# Altium schematic sheet MOSFET_Driver_Sheet1.SchDoc
size 420 x 297 mm; SheetNumber: 12; SheetTotal: 32
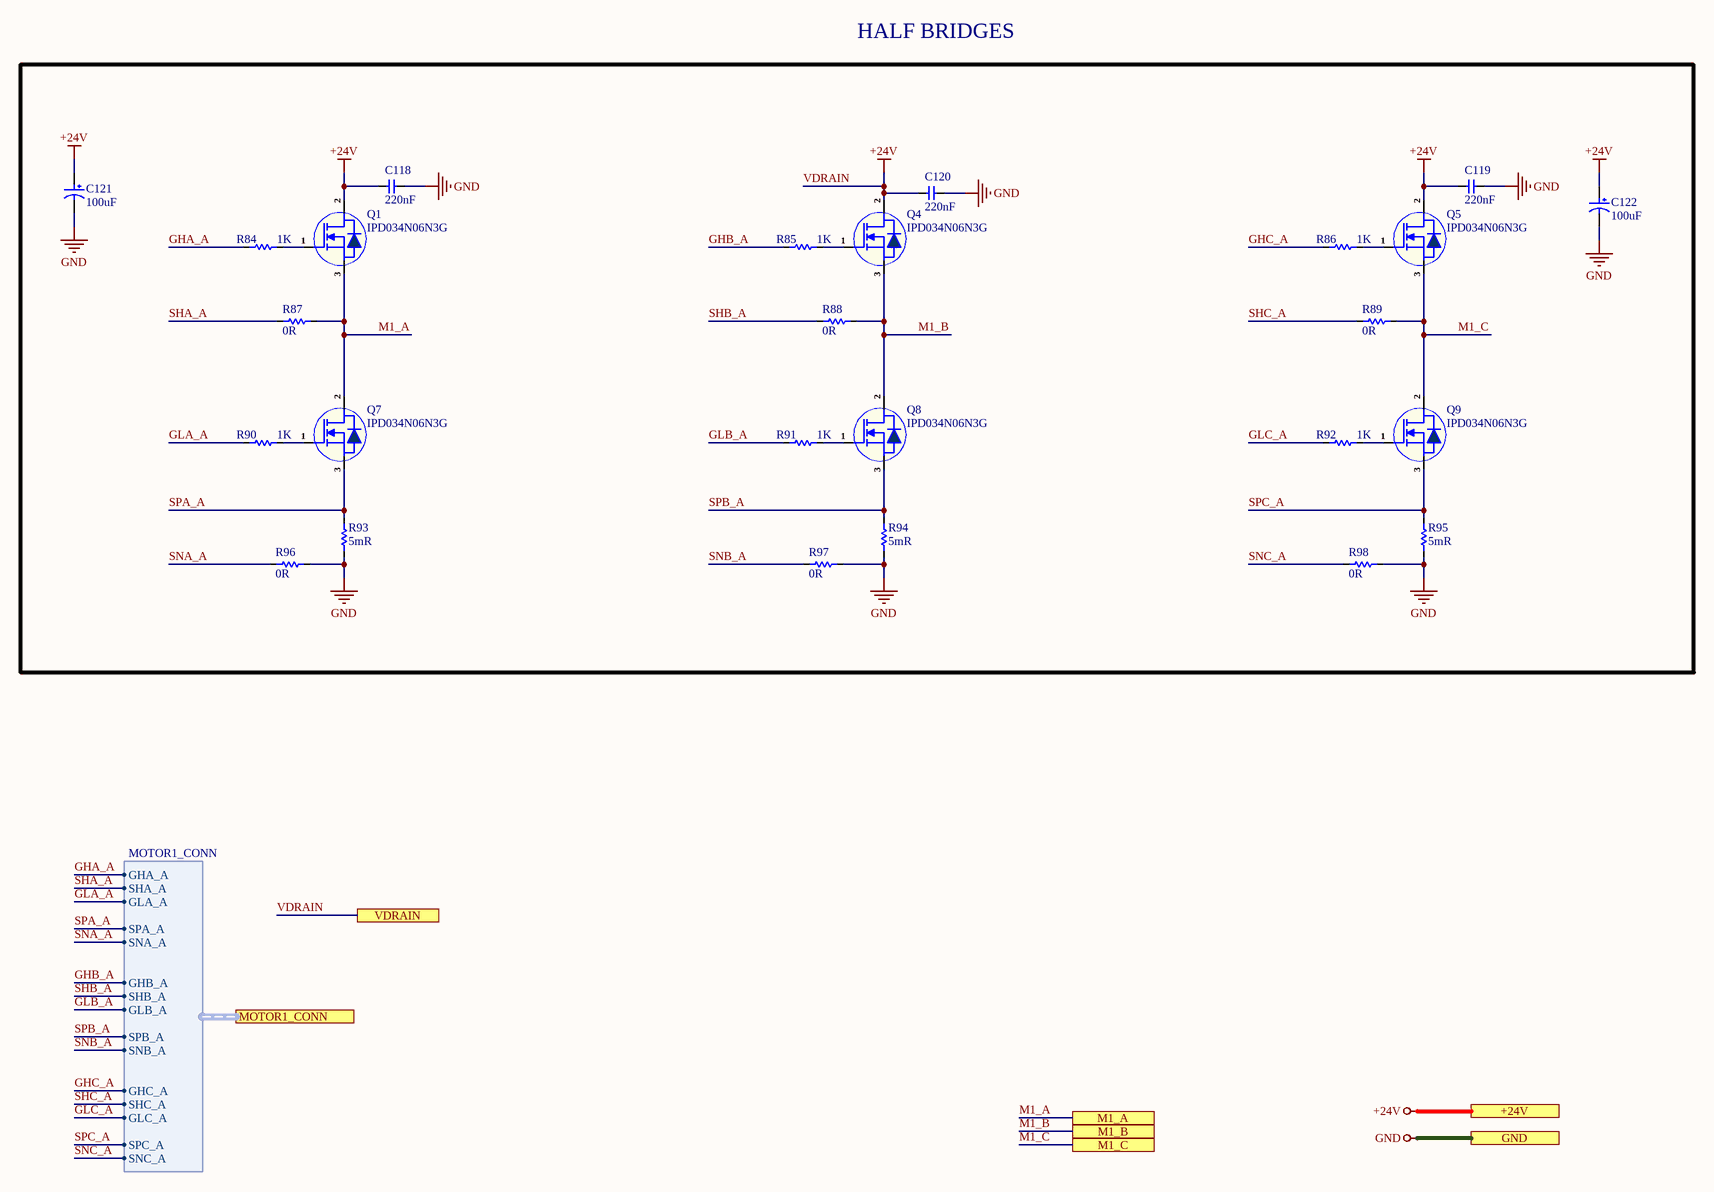
[diagram p0: MOSFET_Driver_Sheet1.SchDoc]

## Parts
C118  220nF  [Cap-0805]
C119  220nF  [Cap-0805]
C120  220nF  [Cap-0805]
C121  100uF  [RVT1A101M0605]
C122  100uF  [RVT1A101M0605]
Q1  IPD034N06N3G  [TO-252-2L]
Q4  IPD034N06N3G  [TO-252-2L]
Q5  IPD034N06N3G  [TO-252-2L]
Q7  IPD034N06N3G  [TO-252-2L]
Q8  IPD034N06N3G  [TO-252-2L]
Q9  IPD034N06N3G  [TO-252-2L]
R84  1K  [Res-0402]
R85  1K  [Res-0402]
R86  1K  [Res-0402]
R87  0R  [Res-0603]
R88  0R  [Res-0603]
R89  0R  [Res-0603]
R90  1K  [Res-0402]
R91  1K  [Res-0402]
R92  1K  [Res-0402]
R93  5mR  [Res-1206]
R94  5mR  [Res-1206]
R95  5mR  [Res-1206]
R96  0R  [Res-0603]
R97  0R  [Res-0603]
R98  0R  [Res-0603]

## Ports
+24V (see Servo1[4A], Connector_Sheet[5D], DIO_1[5D], DIO_2[5D], DIO_3[5D], DIO_4[5D], MOSFET_Driver_Sheet2[5D], MOSFET_Driver_Sheet3[5D], MOSFET_Driver_Sheet4[5D], Motor_Driver_Sheet1[5D], Motor_Driver_Sheet2[5D], Motor_Driver_Sheet3[5D], Motor_Driver_Sheet4[5D], Power_Sheet[5D]), GND (see Servo1[4B], CAN_Sheet[5D], Connector_Sheet[5D], Controller_Sheet[5D], DIO_1[5D], DIO_2[5D], DIO_3[5D], DIO_4[5D], Encoder_Sheet1[5D], Encoder_Sheet2[5D], Encoder_Sheet3[5D], Encoder_Sheet4[5D], EtherCAT_Sheet[5D], MOSFET_Driver_Sheet2[5D], MOSFET_Driver_Sheet3[5D], MOSFET_Driver_Sheet4[5D], Motor_Driver_Sheet1[5D], Motor_Driver_Sheet2[5D], Motor_Driver_Sheet3[5D], Motor_Driver_Sheet4[5D], Power_Sheet[5D], RJ45_Sheet[5D], RS485_RS232_Sheet[3D], Sec_Controller_Sheet1[5D], Sec_Controller_Sheet2[5D], Sec_Controller_Sheet3[5D], Sec_Controller_Sheet4[5D]), M1_A (see Servo1[5B], Connector_Sheet[4D], Servo1[5B]), M1_B (see Servo1[5B], Connector_Sheet[4D], Servo1[5B]), M1_C (see Servo1[5B], Connector_Sheet[4D], Servo1[5B]), MOTOR1_CONN (harness MOTOR1_CONN, see Servo1[4B], Motor_Driver_Sheet1[2D]), VDRAIN (see Servo1[4B], MOSFET_Driver_Sheet2[2D], MOSFET_Driver_Sheet3[2D], MOSFET_Driver_Sheet4[2D], Motor_Driver_Sheet1[2D], Motor_Driver_Sheet2[2D], Motor_Driver_Sheet3[2D], Motor_Driver_Sheet4[2D])

## Harnesses
MOTOR1_CONN: GHA_A, SHA_A, GLA_A, SPA_A, SNA_A, GHB_A, SHB_A, GLB_A, SPB_A, SNB_A, GHC_A, SHC_A, GLC_A, SPC_A, SNC_A

## Nets
GND: C118.1 C119.1 C120.1 C121.2 C122.2 R93.1 R94.1 R95.1 R96.1 R97.1 R98.1 ; port GND
VDRAIN: C118.2 C119.2 C120.2 C121.1 C122.1 Q1.2(D) Q4.2(D) Q5.2(D) ; port +24V, port VDRAIN  [also labelled +24V]
GHA_A: R84.1 ; port MOTOR1_CONN.GHA_A
GHB_A: R85.1 ; port MOTOR1_CONN.GHB_A
GHC_A: R86.1 ; port MOTOR1_CONN.GHC_A
GLA_A: R90.1 ; port MOTOR1_CONN.GLA_A
GLB_A: R91.1 ; port MOTOR1_CONN.GLB_A
GLC_A: R92.1 ; port MOTOR1_CONN.GLC_A
M1_A: Q1.3(S) Q7.2(D) R87.1 ; port M1_A
M1_B: Q4.3(S) Q8.2(D) R88.1 ; port M1_B
M1_C: Q5.3(S) Q9.2(D) R89.1 ; port M1_C
SHA_A: R87.2 ; port MOTOR1_CONN.SHA_A
SHB_A: R88.2 ; port MOTOR1_CONN.SHB_A
SHC_A: R89.2 ; port MOTOR1_CONN.SHC_A
SNA_A: R96.2 ; port MOTOR1_CONN.SNA_A
SNB_A: R97.2 ; port MOTOR1_CONN.SNB_A
SNC_A: R98.2 ; port MOTOR1_CONN.SNC_A
SPA_A: Q7.3(S) R93.2 ; port MOTOR1_CONN.SPA_A
SPB_A: Q8.3(S) R94.2 ; port MOTOR1_CONN.SPB_A
SPC_A: Q9.3(S) R95.2 ; port MOTOR1_CONN.SPC_A
NetQ1_1: Q1.1(G) R84.2
NetQ4_1: Q4.1(G) R85.2
NetQ5_1: Q5.1(G) R86.2
NetQ7_1: Q7.1(G) R90.2
NetQ8_1: Q8.1(G) R91.2
NetQ9_1: Q9.1(G) R92.2

## Notes on the sheet
- HALF BRIDGES
- File:
- Title:
- Date:
- Page
- Num:
- Total:
- Drawn By: Huzaifa Ali

## Library data of the parts
C118-C120 = 08051C224K4T2A: CAP CER 0.22UF 100V X7R 0805; Manufacturer: Kyocera AVX; Tolerance: 10%; Item Type: Capacitor; Supplier 1: Digi-Key; Manufacturer Part Number: 08051C224K4T2A; RoHS: Yes; Category: Ceramic Capacitors; Stock 1: 151; Pricing 1: 1=0.27000, 10=0.18500, 50=0.12320, 100=0.10470, 500=0.07392, 1000=0.06468 (USD); Mount: Surface Mount; Case/Package: 0805; Contact Plating: Tin; Min Operating Temperature: -55°C; Max Operating Temperature: 125°C; Termination: Wraparound; Capacitance: 220nF; Dielectric: X7R; Voltage Rating (DC): 100V; Length: 2.01mm; RoHS Compliant: Yes; ComponentLink1URL: http://datasheets.avx.com/AutoMLCC.pdf?src-supplier=Avnet+Asia; ComponentLink1Description: http://datasheets.avx.com/AutoMLCC.pdf?src-supplier=Avnet+Asia; Supplier Part Number 1: 478-13049-1-ND; LCSC Part Number: C2176107
C121 C122 = RVT1A101M0605: 100uF 10V 55mA@120Hz ±20% SMD,D6.3xL5.4mm Aluminum Electrolytic Capacitors - SMD ROHS; Manufacturer: ROQANG; Manufacturer Part Number: RVT1A101M0605; Package: SMD,D6.3xL5.4mm; LCSC Part Number: C72474; Item Type: Capacitor; ComponentLink1Description: LCSC; ComponentLink1URL: https://www.lcsc.com/product-detail/Aluminum-Electrolytic-Capacitors-SMD_ROQANG-RVT1A101M0605_C72474.html
Q1 Q4 Q5 Q7-Q9 = IPD034N06N3G: MOSFET N-CH 60V 100A TO252-3; Manufacturer: Infineon; Supplier: Mouser; Supplier Part Number: 726-IPD034N06N3G; Manufacturer Part Number: IPD034N06N3G; RoHS: Yes; Stock: 7587; Pricing: 1=1.76, 10=1.48, 50=1.48, 100=1.2, 1000=0.837, 10000=0.747 (USD); LCSC Part Number: C94897; Item Type: Mosfet
R84-R86 R90-R92 = RC0402FR-071KL: RES 1K OHM 1% 1/16W 0402; Manufacturer: Yageo; Resistance: 1kR; Temperature Coefficient: 100ppm/°C; Voltage Rating (DC): 50V; Power Rating: 62.5mW; Max Power Dissipation: 63mW; Item Type: Resistor; Supplier 1: Avnet; Manufacturer Part Number: RC0402FR-071KL; RoHS: Yes; Category: Chip SMD Resistors; Stock 1: 13030000; Pricing 1: 10000=0.00085, 20000=0.00087, 40000=0.00084, 60000=0.00083, 80000=0.00079, 100000=0.00078, 1000000=0.00076 (USD); Case/Package: 0402; Number of Pins: 2; Case Code (Imperial): 0402; Case Code (Metric): 1005; Size Code: 0402; Min Operating Temperature: -55°C; Max Operating Temperature: 155°C; Resistor Type: Thick Film; Tolerance: 1%; Packaging: Tape and Reel; Voltage Rating: 50V; Termination: SMD/SMT; Features: Moisture Resistant; Series: RC; Number of Terminations: 2; Resistance Tolerance: 1%; Construction: Rectangular; Technology: THICK FILM; Length: 1mm; Width: 0.5mm; Height: 0.32mm; Depth: 0.5mm; Reach SVHC Compliant: Yes; Lead Free: Lead Free; RoHS Compliant: Yes; Military Standard: Not; ComponentLink1URL: https://datasheet.ciiva.com/11819/0900766b80c66297-11819477.pdf?src-supplier=RSComponents; ComponentLink1Description: https://datasheet.ciiva.com/11819/0900766b80c66297-11819477.pdf?src-supplier=RSComponents; ComponentLink2URL: https://datasheet.ciiva.com/7983/1018594-7983502.pdf?src-supplier=Element14; ComponentLink2Description: https://datasheet.ciiva.com/7983/1018594-7983502.pdf?src-supplier=Element14; ComponentLink3URL: https://datasheet.ciiva.com/22747/1018594-22747513.pdf?src-supplier=Element14; ComponentLink3Description: https://datasheet.ciiva.com/22747/1018594-22747513.pdf?src-supplier=Element14; ComponentLink4URL: https://datasheet.ciiva.com/12666/pyu-rc0402-51-rohs-l-6-r-12666741.pdf?src-supplier=Mouser; ComponentLink4Description: https://datasheet.ciiva.com/12666/pyu-rc0402-51-rohs-l-6-r-12666741.pdf?src-supplier=Mouser; ComponentLink5URL: https://datasheet.ciiva.com/7849/1018594-7849869.pdf?src-supplier=Element14; ComponentLink5Description: https://datasheet.ciiva.com/7849/1018594-7849869.pdf?src-supplier=Element14; ComponentLink6URL: https://datasheet.ciiva.com/7849/1018594-7849871.pdf?src-supplier=Element14; ComponentLink6Description: https://datasheet.ciiva.com/7849/1018594-7849871.pdf?src-supplier=Element14; ComponentLink7URL: https://datasheet.ciiva.com/17063/pyu-rc0402-51-rohs-l-6-r-17063193.pdf?src-supplier=Future+Electronics; ComponentLink7Description: https://datasheet.ciiva.com/17063/pyu-rc0402-51-rohs-l-6-r-17063193.pdf?src-supplier=Future+Electronics; Supplier Part Number 1: RC0402FR-071KL; LCSC Part Number: C106235
R87-R89 R96-R98 = RC0603JR-070RL: RES 0 OHM JUMPER 1/10W 0603; Manufacturer: Yageo; Resistance: 0mR; Tolerance: 1%; Power Rating: 100mW; Voltage Rating (DC): 50V; Temperature Coefficient: 200ppm/°C; Resistance Tolerance: 5%; Item Type: Resistor; Supplier 1: Digi-Key; Manufacturer Part Number: RC0603JR-070RL; RoHS: Yes; Category: Chip SMD Resistors; Stock 1: 18081776; Pricing 1: 1=0.10000, 10=0.01700, 25=0.01240, 50=0.00960, 100=0.00700, 250=0.00536, 500=0.00430, 1000=0.00316 (USD); Case/Package: 0603; Number of Pins: 2; Contact Plating: Tin,Matte; Case Code (Imperial): 0603; Case Code (Metric): 1608; Size Code: 0603; Min Operating Temperature: -55°C; Max Operating Temperature: 155°C; Resistor Type: Thick Film; Packaging: Tape and Reel; Termination: SMD/SMT; Series: RC; Technology: THICK FILM; Package Quantity: 5000; Voltage Rating: 50V; Features: Moisture Resistant; Max Power Dissipation: 100mW; Number of Terminations: 2; Construction: Rectangular; Length: 1.6mm; Width: 0.8mm; Height: 0.45mm; Depth: 0.8mm; Radiation Hardening: No; Reach SVHC Compliant: No SVHC; Lead Free: Lead Free; RoHS Compliant: Yes; Military Standard: Not; Supplier Part Number 1: 311-0.0GRCT-ND; LCSC Part Number: C95177
R93-R95 = CUM1206-15FR005: 1W 5mΩ ±1% 1206 Current Sense Resistors/Shunt Resistors ROHS; Manufacturer: FORT; Item Type: Capacitor; Manufacturer Part Number: CUM1206-15FR005; Package: 1206; LCSC Part Number: C5185588; ComponentLink1Description: LCSC; ComponentLink1URL: https://www.lcsc.com/product-detail/Current-Sense-Resistors-Shunt-Resistors_FORT-CUM1206-15FR005_C5185588.html